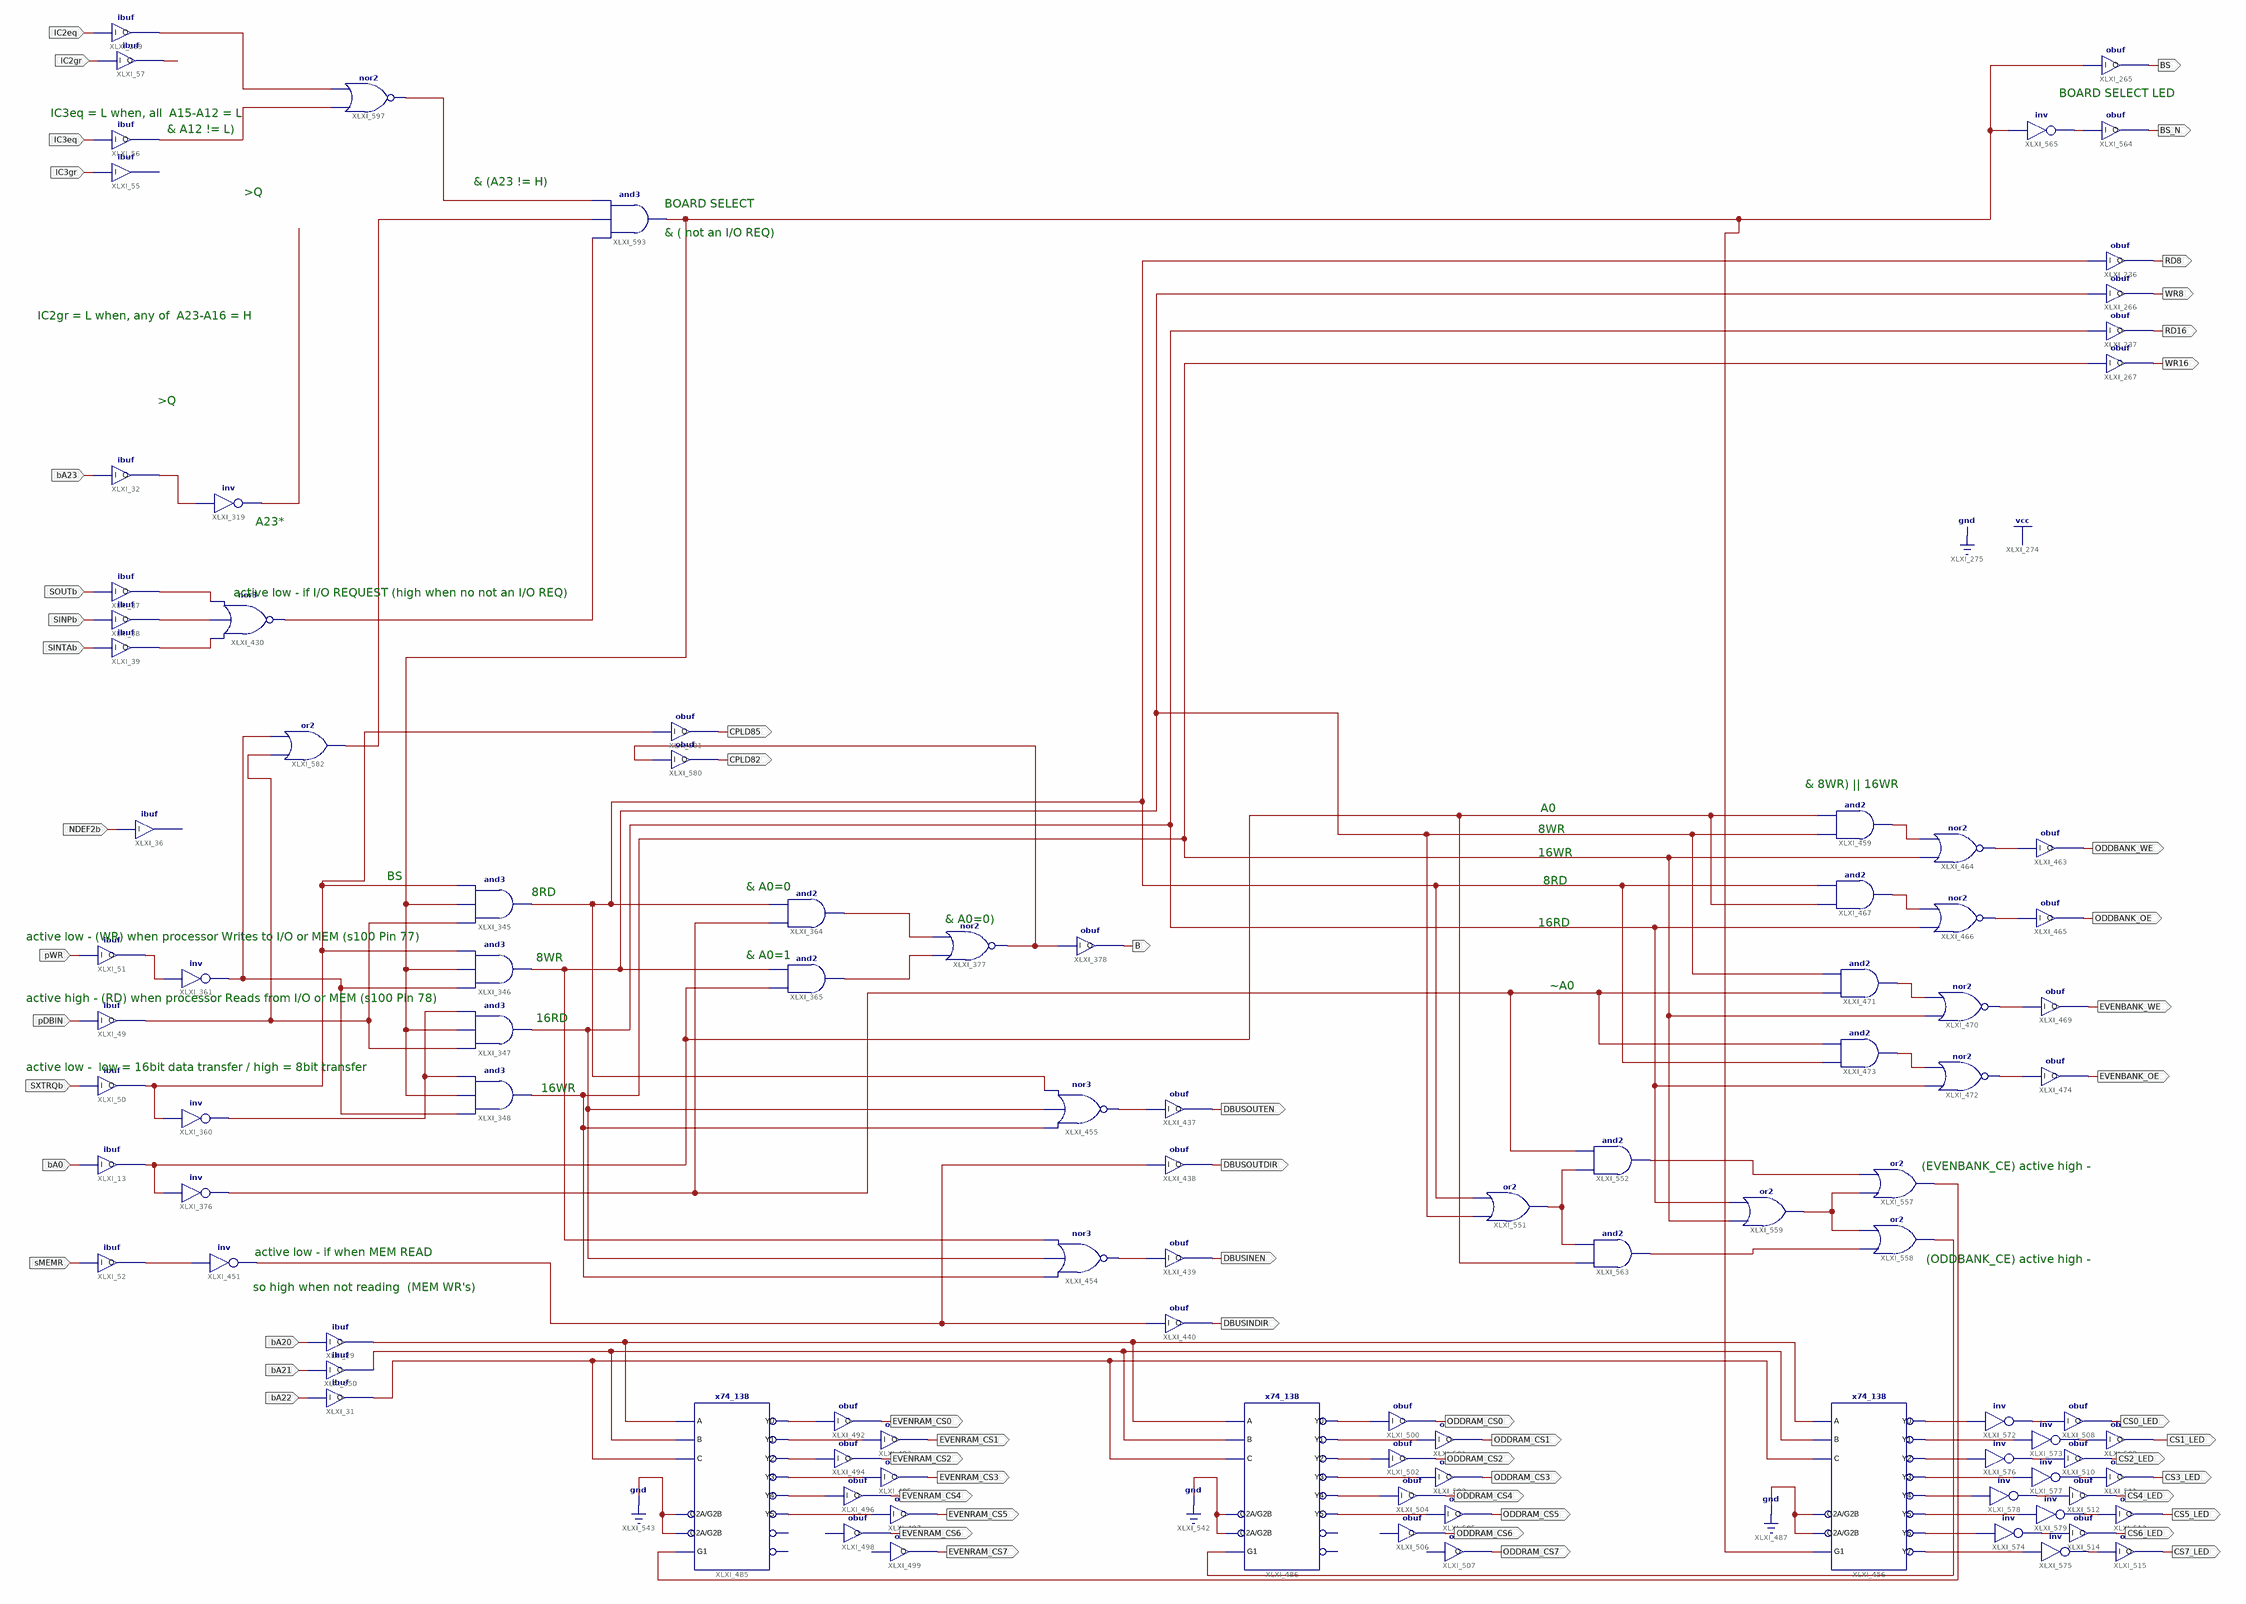
[diagram p0: schematic sheet 1]
// Xilinx ISE schematic U4v1.sch (xc9500xl) as structural Verilog: 102 symbols, 58 ports
module U4v1 (
  input  IC3eq,
  input  bA23,
  input  IC2eq,
  input  SXTRQb,
  input  pDBIN,
  input  bA0,
  input  pWR,
  input  SOUTb,
  input  SINPb,
  input  SINTAb,
  input  NDEF2b,
  input  sMEMR,
  input  bA20,
  input  bA21,
  input  bA22,
  input  IC3gr,
  input  IC2gr,
  output BS,
  output RD8,
  output WR8,
  output RD16,
  output WR16,
  output B,
  output DBUSOUTEN,
  output DBUSINEN,
  output DBUSOUTDIR,
  output DBUSINDIR,
  output ODDBANK_WE,
  output ODDBANK_OE,
  output EVENBANK_WE,
  output EVENBANK_OE,
  output EVENRAM_CS0,
  output EVENRAM_CS1,
  output EVENRAM_CS2,
  output EVENRAM_CS3,
  output EVENRAM_CS4,
  output EVENRAM_CS5,
  output EVENRAM_CS6,
  output EVENRAM_CS7,
  output ODDRAM_CS0,
  output ODDRAM_CS1,
  output ODDRAM_CS2,
  output ODDRAM_CS3,
  output ODDRAM_CS4,
  output ODDRAM_CS5,
  output ODDRAM_CS6,
  output ODDRAM_CS7,
  output BS_N,
  output CS0_LED,
  output CS1_LED,
  output CS2_LED,
  output CS3_LED,
  output CS4_LED,
  output CS5_LED,
  output CS6_LED,
  output CS7_LED,
  output CPLD82,
  output CPLD85
);

  wire XLXN_395, XLXN_399, XLXN_442, XLXN_445, XLXN_457, XLXN_458, XLXN_551, XLXN_567, XLXN_568, XLXN_569,
       XLXN_598, XLXN_601, XLXN_602, XLXN_603, XLXN_611, XLXN_612, XLXN_616, XLXN_618, XLXN_622, XLXN_624,
       XLXN_625, XLXN_626, XLXN_628, XLXN_629, XLXN_630, XLXN_703, XLXN_704, XLXN_705, XLXN_706, XLXN_707,
       XLXN_708, XLXN_711, XLXN_712, XLXN_713, XLXN_714, XLXN_715, XLXN_716, XLXN_736, XLXN_737, XLXN_738,
       XLXN_739, XLXN_743, XLXN_744, XLXN_745, XLXN_746, XLXN_750, XLXN_751, XLXN_752, XLXN_754, XLXN_763,
       XLXN_764, XLXN_765, XLXN_766, XLXN_767, XLXN_768, XLXN_769, XLXN_770, XLXN_771, XLXN_772, XLXN_773,
       XLXN_774, XLXN_775, XLXN_776, XLXN_777, XLXN_778, XLXN_779, XLXN_787, XLXN_789, XLXN_790, XLXN_796,
       XLXN_808, XLXN_810, XLXN_812, XLXN_813, XLXN_815, XLXN_823;

  ibuf XLXI_56 (.I(IC3eq), .O(XLXN_810));
  obuf XLXI_265 (.I(XLXN_779), .O(BS));
  ibuf XLXI_32 (.I(bA23), .O(XLXN_395));
  not XLXI_319 (XLXN_399, XLXN_395);
  ibuf XLXI_289 (.I(IC2eq), .O(XLXN_808));
  obuf XLXI_236 (.I(XLXN_750), .O(RD8));
  obuf XLXI_266 (.I(XLXN_787), .O(WR8));
  obuf XLXI_237 (.I(XLXN_629), .O(RD16));
  obuf XLXI_267 (.I(XLXN_630), .O(WR16));
  obuf XLXI_378 (.I(XLXN_823), .O(B));
  nor XLXI_377 (XLXN_823, XLXN_458, XLXN_457);
  not XLXI_376 (XLXN_743, XLXN_622);
  and XLXI_365 (XLXN_458, XLXN_622, XLXN_787);
  and XLXI_364 (XLXN_457, XLXN_743, XLXN_750);
  not XLXI_361 (XLXN_789, XLXN_445);
  not XLXI_360 (XLXN_442, XLXN_551);
  ibuf XLXI_50 (.I(SXTRQb), .O(XLXN_551));
  ibuf XLXI_49 (.I(pDBIN), .O(XLXN_790));
  ibuf XLXI_13 (.I(bA0), .O(XLXN_622));
  and XLXI_348 (XLXN_630, XLXN_789, XLXN_779, XLXN_442);
  and XLXI_347 (XLXN_629, XLXN_790, XLXN_779, XLXN_442);
  and XLXI_346 (XLXN_787, XLXN_789, XLXN_779, XLXN_551);
  and XLXI_345 (XLXN_750, XLXN_790, XLXN_779, XLXN_551);
  ibuf XLXI_51 (.I(pWR), .O(XLXN_445));
  ibuf XLXI_37 (.I(SOUTb), .O(XLXN_567));
  ibuf XLXI_38 (.I(SINPb), .O(XLXN_568));
  ibuf XLXI_39 (.I(SINTAb), .O(XLXN_569));
  nor XLXI_430 (XLXN_815, XLXN_569, XLXN_568, XLXN_567);
  ibuf XLXI_36 (.I(NDEF2b));  // open: O
  obuf XLXI_437 (.I(XLXN_602), .O(DBUSOUTEN));
  obuf XLXI_439 (.I(XLXN_603), .O(DBUSINEN));
  obuf XLXI_438 (.I(XLXN_601), .O(DBUSOUTDIR));
  obuf XLXI_440 (.I(XLXN_601), .O(DBUSINDIR));
  ibuf XLXI_52 (.I(sMEMR), .O(XLXN_598));
  not XLXI_451 (XLXN_601, XLXN_598);
  nor XLXI_454 (XLXN_603, XLXN_630, XLXN_629, XLXN_787);
  nor XLXI_455 (XLXN_602, XLXN_630, XLXN_629, XLXN_750);
  and XLXI_459 (XLXN_611, XLXN_787, XLXN_622);
  obuf XLXI_463 (.I(XLXN_612), .O(ODDBANK_WE));
  nor XLXI_464 (XLXN_612, XLXN_630, XLXN_611);
  nor XLXI_466 (XLXN_618, XLXN_629, XLXN_616);
  and XLXI_467 (XLXN_616, XLXN_622, XLXN_750);
  obuf XLXI_465 (.I(XLXN_618), .O(ODDBANK_OE));
  obuf XLXI_469 (.I(XLXN_625), .O(EVENBANK_WE));
  nor XLXI_470 (XLXN_625, XLXN_630, XLXN_624);
  and XLXI_471 (XLXN_624, XLXN_743, XLXN_787);
  nor XLXI_472 (XLXN_628, XLXN_629, XLXN_626);
  and XLXI_473 (XLXN_626, XLXN_750, XLXN_743);
  obuf XLXI_474 (.I(XLXN_628), .O(EVENBANK_OE));
  x74_138 XLXI_485 (
    .A(XLXN_736), .B(XLXN_737), .C(XLXN_738), .G1(XLXN_751), .G2A(1'b0), .G2B(1'b0), .Y0(XLXN_711),
    .Y1(XLXN_712), .Y2(XLXN_713), .Y3(XLXN_714), .Y4(XLXN_715), .Y5(XLXN_716));  // open: Y6, Y7
  x74_138 XLXI_486 (
    .A(XLXN_736), .B(XLXN_737), .C(XLXN_738), .G1(XLXN_752), .G2A(1'b0), .G2B(1'b0), .Y0(XLXN_703),
    .Y1(XLXN_704), .Y2(XLXN_705), .Y3(XLXN_706), .Y4(XLXN_707), .Y5(XLXN_708));  // open: Y6, Y7
  x74_138 XLXI_456 (
    .A(XLXN_736), .B(XLXN_737), .C(XLXN_738), .G1(XLXN_779), .G2A(1'b0), .G2B(1'b0), .Y0(XLXN_776),
    .Y1(XLXN_777), .Y2(XLXN_778), .Y3(XLXN_775), .Y4(XLXN_774), .Y5(XLXN_773), .Y6(XLXN_772), .Y7(XLXN_771));
  obuf XLXI_492 (.I(XLXN_711), .O(EVENRAM_CS0));
  obuf XLXI_493 (.I(XLXN_712), .O(EVENRAM_CS1));
  obuf XLXI_494 (.I(XLXN_713), .O(EVENRAM_CS2));
  obuf XLXI_495 (.I(XLXN_714), .O(EVENRAM_CS3));
  obuf XLXI_496 (.I(XLXN_715), .O(EVENRAM_CS4));
  obuf XLXI_497 (.I(XLXN_716), .O(EVENRAM_CS5));
  obuf XLXI_498 (.O(EVENRAM_CS6));  // open: I
  obuf XLXI_499 (.O(EVENRAM_CS7));  // open: I
  obuf XLXI_500 (.I(XLXN_703), .O(ODDRAM_CS0));
  obuf XLXI_501 (.I(XLXN_704), .O(ODDRAM_CS1));
  obuf XLXI_502 (.I(XLXN_705), .O(ODDRAM_CS2));
  obuf XLXI_503 (.I(XLXN_706), .O(ODDRAM_CS3));
  obuf XLXI_504 (.I(XLXN_707), .O(ODDRAM_CS4));
  obuf XLXI_505 (.I(XLXN_708), .O(ODDRAM_CS5));
  obuf XLXI_506 (.O(ODDRAM_CS6));  // open: I
  obuf XLXI_507 (.O(ODDRAM_CS7));  // open: I
  obuf XLXI_509 (.I(XLXN_765), .O(CS1_LED));
  obuf XLXI_510 (.I(XLXN_766), .O(CS2_LED));
  ibuf XLXI_29 (.I(bA20), .O(XLXN_736));
  ibuf XLXI_31 (.I(bA22), .O(XLXN_738));
  ibuf XLXI_550 (.I(bA21), .O(XLXN_737));
  or XLXI_557 (XLXN_751, XLXN_746, XLXN_744);
  or XLXI_558 (XLXN_752, XLXN_745, XLXN_746);
  or XLXI_559 (XLXN_746, XLXN_630, XLXN_629);
  or XLXI_551 (XLXN_739, XLXN_787, XLXN_750);
  and XLXI_552 (XLXN_744, XLXN_739, XLXN_743);
  and XLXI_563 (XLXN_745, XLXN_622, XLXN_739);
  obuf XLXI_564 (.I(XLXN_754), .O(BS_N));
  not XLXI_565 (XLXN_754, XLXN_779);
  obuf XLXI_508 (.I(XLXN_764), .O(CS0_LED));
  obuf XLXI_511 (.I(XLXN_767), .O(CS3_LED));
  obuf XLXI_512 (.I(XLXN_768), .O(CS4_LED));
  obuf XLXI_513 (.I(XLXN_769), .O(CS5_LED));
  obuf XLXI_514 (.I(XLXN_770), .O(CS6_LED));
  obuf XLXI_515 (.I(XLXN_763), .O(CS7_LED));
  not XLXI_572 (XLXN_764, XLXN_776);
  not XLXI_573 (XLXN_765, XLXN_777);
  not XLXI_576 (XLXN_766, XLXN_778);
  not XLXI_577 (XLXN_767, XLXN_775);
  not XLXI_578 (XLXN_768, XLXN_774);
  not XLXI_579 (XLXN_769, XLXN_773);
  not XLXI_574 (XLXN_770, XLXN_772);
  not XLXI_575 (XLXN_763, XLXN_771);
  or XLXI_582 (XLXN_812, XLXN_790, XLXN_789);
  and XLXI_593 (XLXN_779, XLXN_815, XLXN_812, XLXN_813);
  ibuf XLXI_55 (.I(IC3gr));  // open: O
  ibuf XLXI_57 (.I(IC2gr), .O(XLXN_796));
  nor XLXI_597 (XLXN_813, XLXN_810, XLXN_808);
  obuf XLXI_580 (.I(XLXN_823), .O(CPLD82));
  obuf XLXI_601 (.I(XLXN_551), .O(CPLD85));

  // Notes on the sheet:
  //   BOARD SELECT LED
  //   IC3eq = L when, all  A15-A12 = L
  //   & A12 != L)
  //   & (A23 != H)
  //   >Q
  //   BOARD SELECT
  //   & ( not an I/O REQ)
  //   IC2gr = L when, any of  A23-A16 = H
  //   >Q
  //   A23*
  //   active low - if I/O REQUEST (high when no not an I/O REQ)
  //   & 8WR) || 16WR
  //   A0
  //   8WR
  //   16WR
  //   BS
  //   8RD
  //   & A0=0
  //   8RD
  //   & A0=0)
  //   16RD
  //   active low - (WR) when processor Writes to I/O or MEM (s100 Pin 77)
  //   & A0=1
  //   8WR
  //   ~A0
  //   active high - (RD) when processor Reads from I/O or MEM (s100 Pin 78)
  //   16RD
  //   active low -  low = 16bit data transfer / high = 8bit transfer
  //   16WR
  //   (EVENBANK_CE) active high -
  //   active low - if when MEM READ
  //   (ODDBANK_CE) active high -
  //   so high when not reading  (MEM WR's)
endmodule
